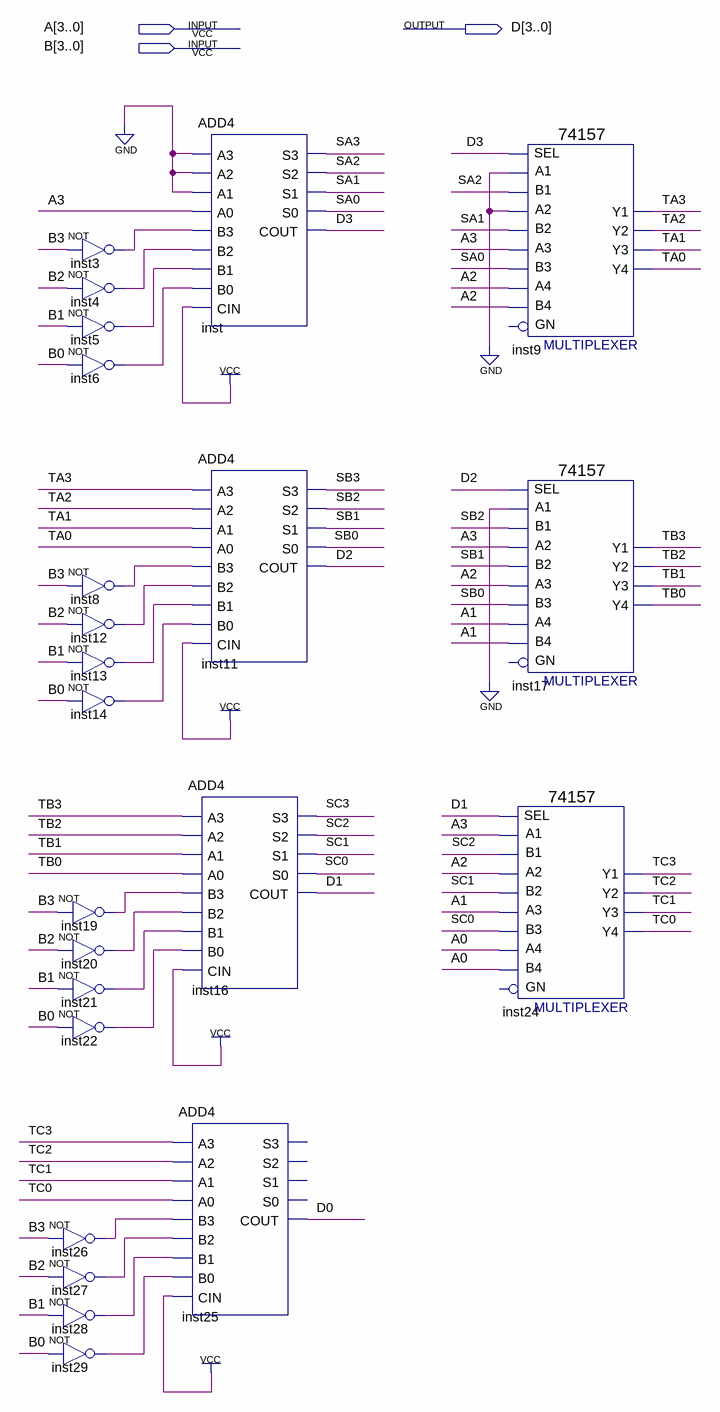
[diagram p0: schematic sheet]
// Quartus schematic DIV4.bdf as structural Verilog: 23 symbols, 3 pins
module DIV4 (
  input  [3:0] A,
  input  [3:0] B,
  output [3:0] D
);

  wire inst3_out, inst4_out, inst5_out, inst6_out, inst8_out, inst12_out, inst13_out, inst14_out, inst19_out,
       inst20_out, inst21_out, inst22_out, inst26_out, inst27_out, inst28_out, inst29_out, SA0, SA1, SA2,
       SA3, SB0, SB1, SB2, SB3, SC0, SC1, SC2, SC3, TA0, TA1, TA2, TA3, TB0, TB1, TB2, TB3, TC0, TC1, TC2,
       TC3;

  not inst3 (inst3_out, B[3]);
  not inst4 (inst4_out, B[2]);
  not inst5 (inst5_out, B[1]);
  not inst6 (inst6_out, B[0]);
  not inst8 (inst8_out, B[3]);
  not inst12 (inst12_out, B[2]);
  not inst13 (inst13_out, B[1]);
  not inst14 (inst14_out, B[0]);
  not inst19 (inst19_out, B[3]);
  not inst20 (inst20_out, B[2]);
  not inst21 (inst21_out, B[1]);
  not inst22 (inst22_out, B[0]);
  not inst26 (inst26_out, B[3]);
  not inst27 (inst27_out, B[2]);
  not inst28 (inst28_out, B[1]);
  not inst29 (inst29_out, B[0]);
  ADD4 inst (
    .A3(1'b0), .A2(1'b0), .A1(1'b0), .A0(A[3]), .B3(inst3_out), .B2(inst4_out), .B1(inst5_out),
    .B0(inst6_out), .CIN(1'b1), .S3(SA3), .S2(SA2), .S1(SA1), .S0(SA0), .COUT(D[3]));
  ADD4 inst11 (
    .A3(TA3), .A2(TA2), .A1(TA1), .A0(TA0), .B3(inst8_out), .B2(inst12_out), .B1(inst13_out),
    .B0(inst14_out), .CIN(1'b1), .S3(SB3), .S2(SB2), .S1(SB1), .S0(SB0), .COUT(D[2]));
  ADD4 inst16 (
    .A3(TB3), .A2(TB2), .A1(TB1), .A0(TB0), .B3(inst19_out), .B2(inst20_out), .B1(inst21_out),
    .B0(inst22_out), .CIN(1'b1), .S3(SC3), .S2(SC2), .S1(SC1), .S0(SC0), .COUT(D[1]));
  ADD4 inst25 (
    .A3(TC3), .A2(TC2), .A1(TC1), .A0(TC0), .B3(inst26_out), .B2(inst27_out), .B1(inst28_out),
    .B0(inst29_out), .CIN(1'b1), .COUT(D[0]));  // open: S3, S2, S1, S0
  \74157  inst24 (
    .A1(A[3]), .B1(SC2), .SEL(D[1]), .B2(SC1), .A3(A[1]), .B3(SC0), .A2(A[2]), .B4(A[0]), .A4(A[0]),
    .Y2(TC2), .Y1(TC3), .Y4(TC0), .Y3(TC1));  // open: GN
  \74157  inst9 (
    .A1(1'b0), .B1(SA2), .SEL(D[3]), .B2(SA1), .A3(A[3]), .B3(SA0), .A2(1'b0), .B4(A[2]), .A4(A[2]),
    .Y2(TA2), .Y1(TA3), .Y4(TA0), .Y3(TA1));  // open: GN
  \74157  inst17 (
    .A1(1'b0), .B1(SB2), .SEL(D[2]), .B2(SB1), .A3(A[2]), .B3(SB0), .A2(A[3]), .B4(A[1]), .A4(A[1]),
    .Y2(TB2), .Y1(TB3), .Y4(TB0), .Y3(TB1));  // open: GN
endmodule
